# Altium schematic sheet doanthue_13_4_2020.SchDoc
size A3
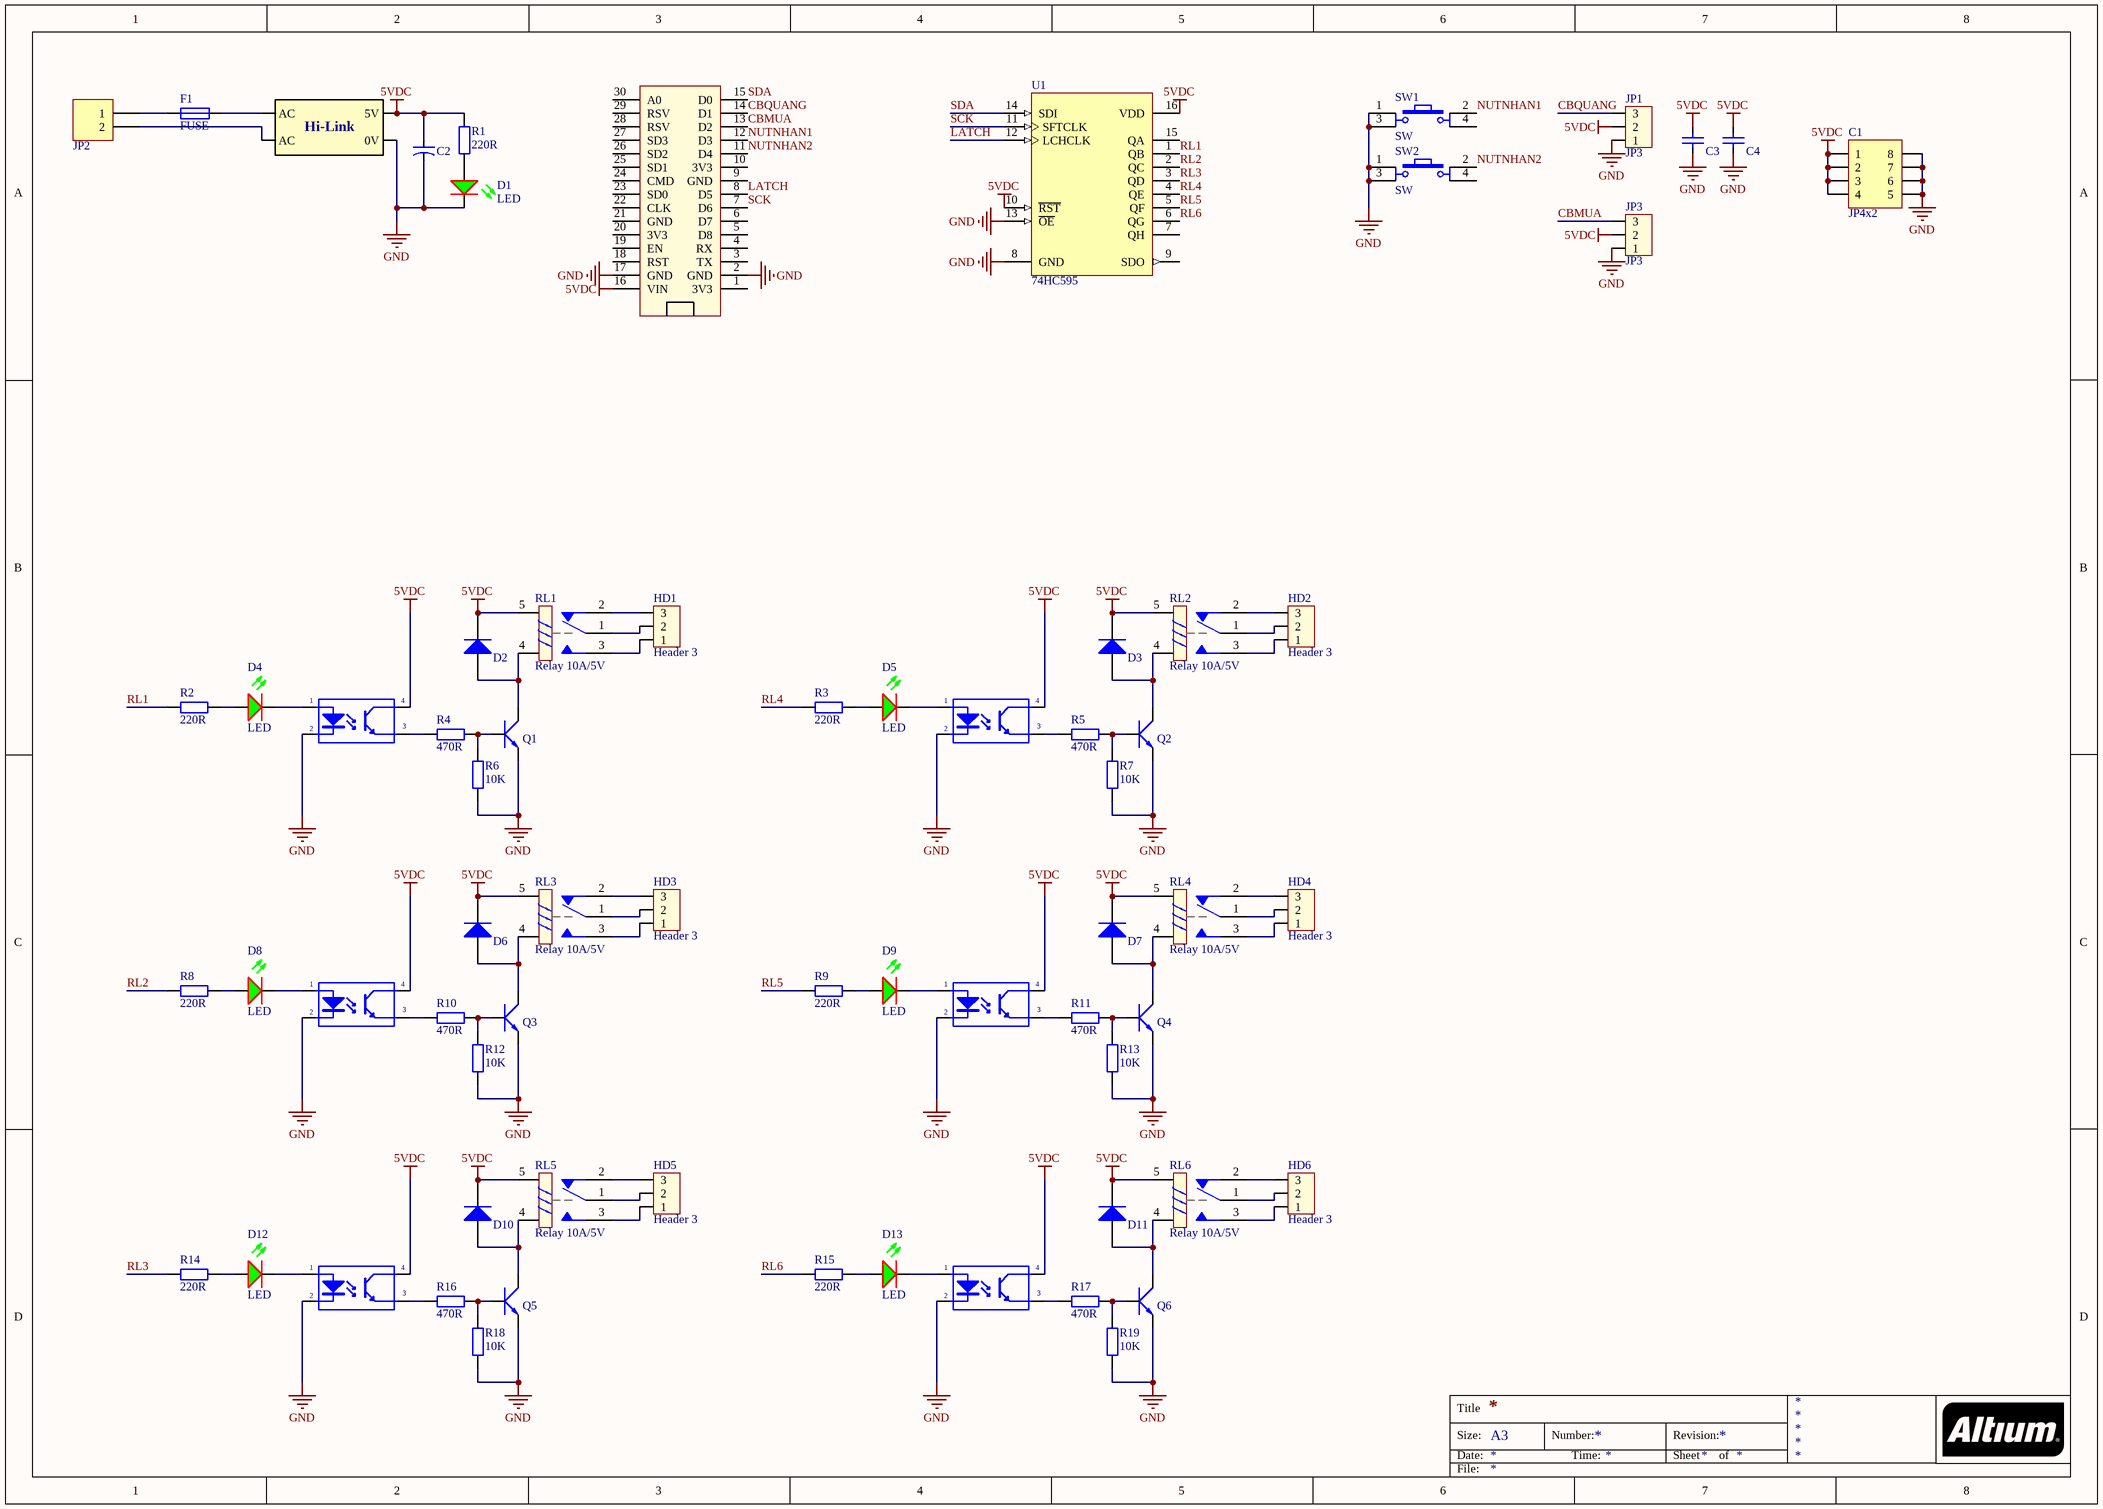
[diagram p0: doanthue_13_4_2020.SchDoc]

## Parts
*1  Hi-Link  [Hi-Link]  (value not drawn)
*2  Module ESP8266 CP2102  [Module ESP8266 CP2102]  (value not drawn)
C1  JP4x2  [JP4-D2T]
C2  10uF  [CA-ALU-2.54]  (value not drawn)
C3  0805 104  [CAP-0805-SC]  (value not drawn)
C4  0805 104  [CAP-0805-SC]  (value not drawn)
D1  LED  [LED_SMD_0805]
D2  DIODE  [DO 214AC]  (value not drawn)
D3  DIODE  [DO 214AC]  (value not drawn)
D4  LED  [LED_SMD_0805]
D5  LED  [LED_SMD_0805]
D6  DIODE  [DO 214AC]  (value not drawn)
D7  DIODE  [DO 214AC]  (value not drawn)
D8  LED  [LED_SMD_0805]
D9  LED  [LED_SMD_0805]
D10  DIODE  [DO 214AC]  (value not drawn)
D11  DIODE  [DO 214AC]  (value not drawn)
D12  LED  [LED_SMD_0805]
D13  LED  [LED_SMD_0805]
F1  FUSE  [FUSE-SC]
HD1  Header 3  [HED3]
HD2  Header 3  [HED3]
HD3  Header 3  [HED3]
HD4  Header 3  [HED3]
HD5  Header 3  [HED3]
HD6  Header 3  [HED3]
JP1  JP3  [CON3]
JP2  Header 2_1  [HED2]  (value not drawn)
JP3  JP3  [CON3]
Q1  C1815  [SOT23]  (value not drawn)
Q2  C1815  [SOT23]  (value not drawn)
Q3  C1815  [SOT23]  (value not drawn)
Q4  C1815  [SOT23]  (value not drawn)
Q5  C1815  [SOT23]  (value not drawn)
Q6  C1815  [SOT23]  (value not drawn)
R1  220R  [SM-RES-0805]
R2  220R  [SM-RES-0805]
R3  220R  [SM-RES-0805]
R4  470R  [SM-RES-0805]
R5  470R  [SM-RES-0805]
R6  10K  [SM-RES-0805]
R7  10K  [SM-RES-0805]
R8  220R  [SM-RES-0805]
R9  220R  [SM-RES-0805]
R10  470R  [SM-RES-0805]
R11  470R  [SM-RES-0805]
R12  10K  [SM-RES-0805]
R13  10K  [SM-RES-0805]
R14  220R  [SM-RES-0805]
R15  220R  [SM-RES-0805]
R16  470R  [SM-RES-0805]
R17  470R  [SM-RES-0805]
R18  10K  [SM-RES-0805]
R19  10K  [SM-RES-0805]
RL1  Relay 10A/5V  [RL_SPDT_10A]
RL2  Relay 10A/5V  [RL_SPDT_10A]
RL3  Relay 10A/5V  [RL_SPDT_10A]
RL4  Relay 10A/5V  [RL_SPDT_10A]
RL5  Relay 10A/5V  [RL_SPDT_10A]
RL6  Relay 10A/5V  [RL_SPDT_10A]
SW1  SW  [SW4B]
SW2  SW  [SW4B]
U1  74HC595  [SO-16-M]
U2  PC817  [PC817]  (value not drawn)
U3  PC817  [PC817]  (value not drawn)
U4  PC817  [PC817]  (value not drawn)
U5  PC817  [PC817]  (value not drawn)
U6  PC817  [PC817]  (value not drawn)
U7  PC817  [PC817]  (value not drawn)

## Nets
5VDC: *1.4(5V) *2.16(VIN) C1.1 C1.2 C1.3 C1.4 C2.1 C3.1 C4.1 D2.2(K) D3.2(K) D6.2(K) D7.2(K) D10.2(K) D11.2(K) JP1.2 JP3.2 R1.2 RL1.5 RL2.5 RL3.5 RL4.5 RL5.5 RL6.5 U1.10(~{RST}) U1.16(VDD) U2.4(C) U3.4(C) U4.4(C) U5.4(C) U6.4(C) U7.4(C)
GND: *1.3(0V) *2.2(GND) *2.17(GND) C1.5 C1.6 C1.7 C1.8 C2.2 C3.2 C4.2 D1.2(K) JP1.1 JP3.1 Q1.2(E) Q2.2(E) Q3.2(E) Q4.2(E) Q5.2(E) Q6.2(E) R6.1 R7.1 R12.1 R13.1 R18.1 R19.1 SW1.1 SW1.3 SW2.1 SW2.3 U1.8(GND) U1.13(~{OE}) U2.2(K) U3.2(K) U4.2(K) U5.2(K) U6.2(K) U7.2(K)
CBMUA: *2.13(D2) JP3.3
CBQUANG: *2.14(D1) JP1.3
LATCH: *2.8(D5) U1.12(LCHCLK)
NUTNHAN1: *2.12(D3) SW1.2
NUTNHAN2: *2.11(D4) SW2.2
RL1: R2.1 U1.1(QB)
RL2: R8.1 U1.2(QC)
RL3: R14.1 U1.3(QD)
RL4: R3.1 U1.4(QE)
RL5: R9.1 U1.5(QF)
RL6: R15.1 U1.6(QG)
SCK: *2.7(D6) U1.11(SFTCLK)
SDA: *2.15(D0) U1.14(SDI)
Net*1_1: *1.1(AC) F1.2
Net*1_2: *1.2(AC) JP2.2
NetD1_1: D1.1(A) R1.1
NetD2_1: D2.1(A) Q1.3(C) RL1.4
NetD3_1: D3.1(A) Q2.3(C) RL2.4
NetD4_1: D4.1(A) R2.2
NetD4_2: D4.2(K) U2.1(A)
NetD5_1: D5.1(A) R3.2
NetD5_2: D5.2(K) U3.1(A)
NetD6_1: D6.1(A) Q3.3(C) RL3.4
NetD7_1: D7.1(A) Q4.3(C) RL4.4
NetD8_1: D8.1(A) R8.2
NetD8_2: D8.2(K) U4.1(A)
NetD9_1: D9.1(A) R9.2
NetD9_2: D9.2(K) U5.1(A)
NetD10_1: D10.1(A) Q5.3(C) RL5.4
NetD11_1: D11.1(A) Q6.3(C) RL6.4
NetD12_1: D12.1(A) R14.2
NetD12_2: D12.2(K) U6.1(A)
NetD13_1: D13.1(A) R15.2
NetD13_2: D13.2(K) U7.1(A)
NetF1_1: F1.1 JP2.1
NetHD1_1: HD1.1 RL1.3
NetHD1_2: HD1.2 RL1.1
NetHD1_3: HD1.3 RL1.2
NetHD2_1: HD2.1 RL2.3
NetHD2_2: HD2.2 RL2.1
NetHD2_3: HD2.3 RL2.2
NetHD3_1: HD3.1 RL3.3
NetHD3_2: HD3.2 RL3.1
NetHD3_3: HD3.3 RL3.2
NetHD4_1: HD4.1 RL4.3
NetHD4_2: HD4.2 RL4.1
NetHD4_3: HD4.3 RL4.2
NetHD5_1: HD5.1 RL5.3
NetHD5_2: HD5.2 RL5.1
NetHD5_3: HD5.3 RL5.2
NetHD6_1: HD6.1 RL6.3
NetHD6_2: HD6.2 RL6.1
NetHD6_3: HD6.3 RL6.2
NetQ1_1: Q1.1(B) R4.2 R6.2
NetQ2_1: Q2.1(B) R5.2 R7.2
NetQ3_1: Q3.1(B) R10.2 R12.2
NetQ4_1: Q4.1(B) R11.2 R13.2
NetQ5_1: Q5.1(B) R16.2 R18.2
NetQ6_1: Q6.1(B) R17.2 R19.2
NetR4_1: R4.1 U2.3(E)
NetR5_1: R5.1 U3.3(E)
NetR10_1: R10.1 U4.3(E)
NetR11_1: R11.1 U5.3(E)
NetR16_1: R16.1 U6.3(E)
NetR17_1: R17.1 U7.3(E)

Not connected (* = marked no-connect by the designer): *2 1(3V3) 3(TX) 4(RX) 5(D8) 6(D7) 9(GND) 10(3V3) 18(RST) 19(EN) 20(3V3) 21(GND) 22(CLK) 23(SD0) 24(CMD) 25(SD1) 26(SD2) 27(SD3) 28(RSV) 29(RSV) 30(A0); SW1 4; SW2 4; U1 7(QH) 9(SDO) 15(QA)

## Notes on the sheet
- Title
- Size:
- Date:
- A3
- Number:
- Time:
- Revision:
- Sheet
- of
- File:

## Library data of the parts
C1 = JP4x2: WR-PHD 2.54 mm Dual Socket Header; Manufacturer: W¨¹rth Elektronik eiSos GmbH; partNo: 61300821821; ComponentLink1 Description: Manufacturer; ComponentLink2 Description: Datasheet; NoPins: 08; Created Date: 29 March 2013; ComponentLink1URL: http://www.we-online.com; ComponentLink2URL: http://katalog.we-online.de/em/datasheet/6130xx21821.pdf; Created by: Karrer Zheng
C2 = CN-ALU-DIP: Capacitor (Semiconductor SIM Model); Value: 104; LatestRevisionDate: 17-Jul-2002; LatestRevisionNote: Re-released for DXP Platform.; PackageReference: C1206; Publisher: Altium Limited
C3 C4 = CAP-SMDCHIP
HD1-HD6 = Hed3: Header 3 (Green); Value: Header 3
JP1 JP3 = Con3: Connector 3; Value: Connector 3
JP2 = Header 2_1: Header, 2-Pin; Manufacturer: Generic Components; Class: Connector; Value: Header 2
R1-R19 = R1/4W: Resistor 1/4W; Value: R1/4W - 1K
RL1-RL6 = Relay 1: Relay SPDT,10A - 12VDC 5 Pin; Value: Relay SPDT, 10A, 12V
SW1 SW2 = SW4: Switch button 4 pin; Value: Button chip 4 pin